# EAGLE design diode_keyboard (EAGLE 7.4.0)
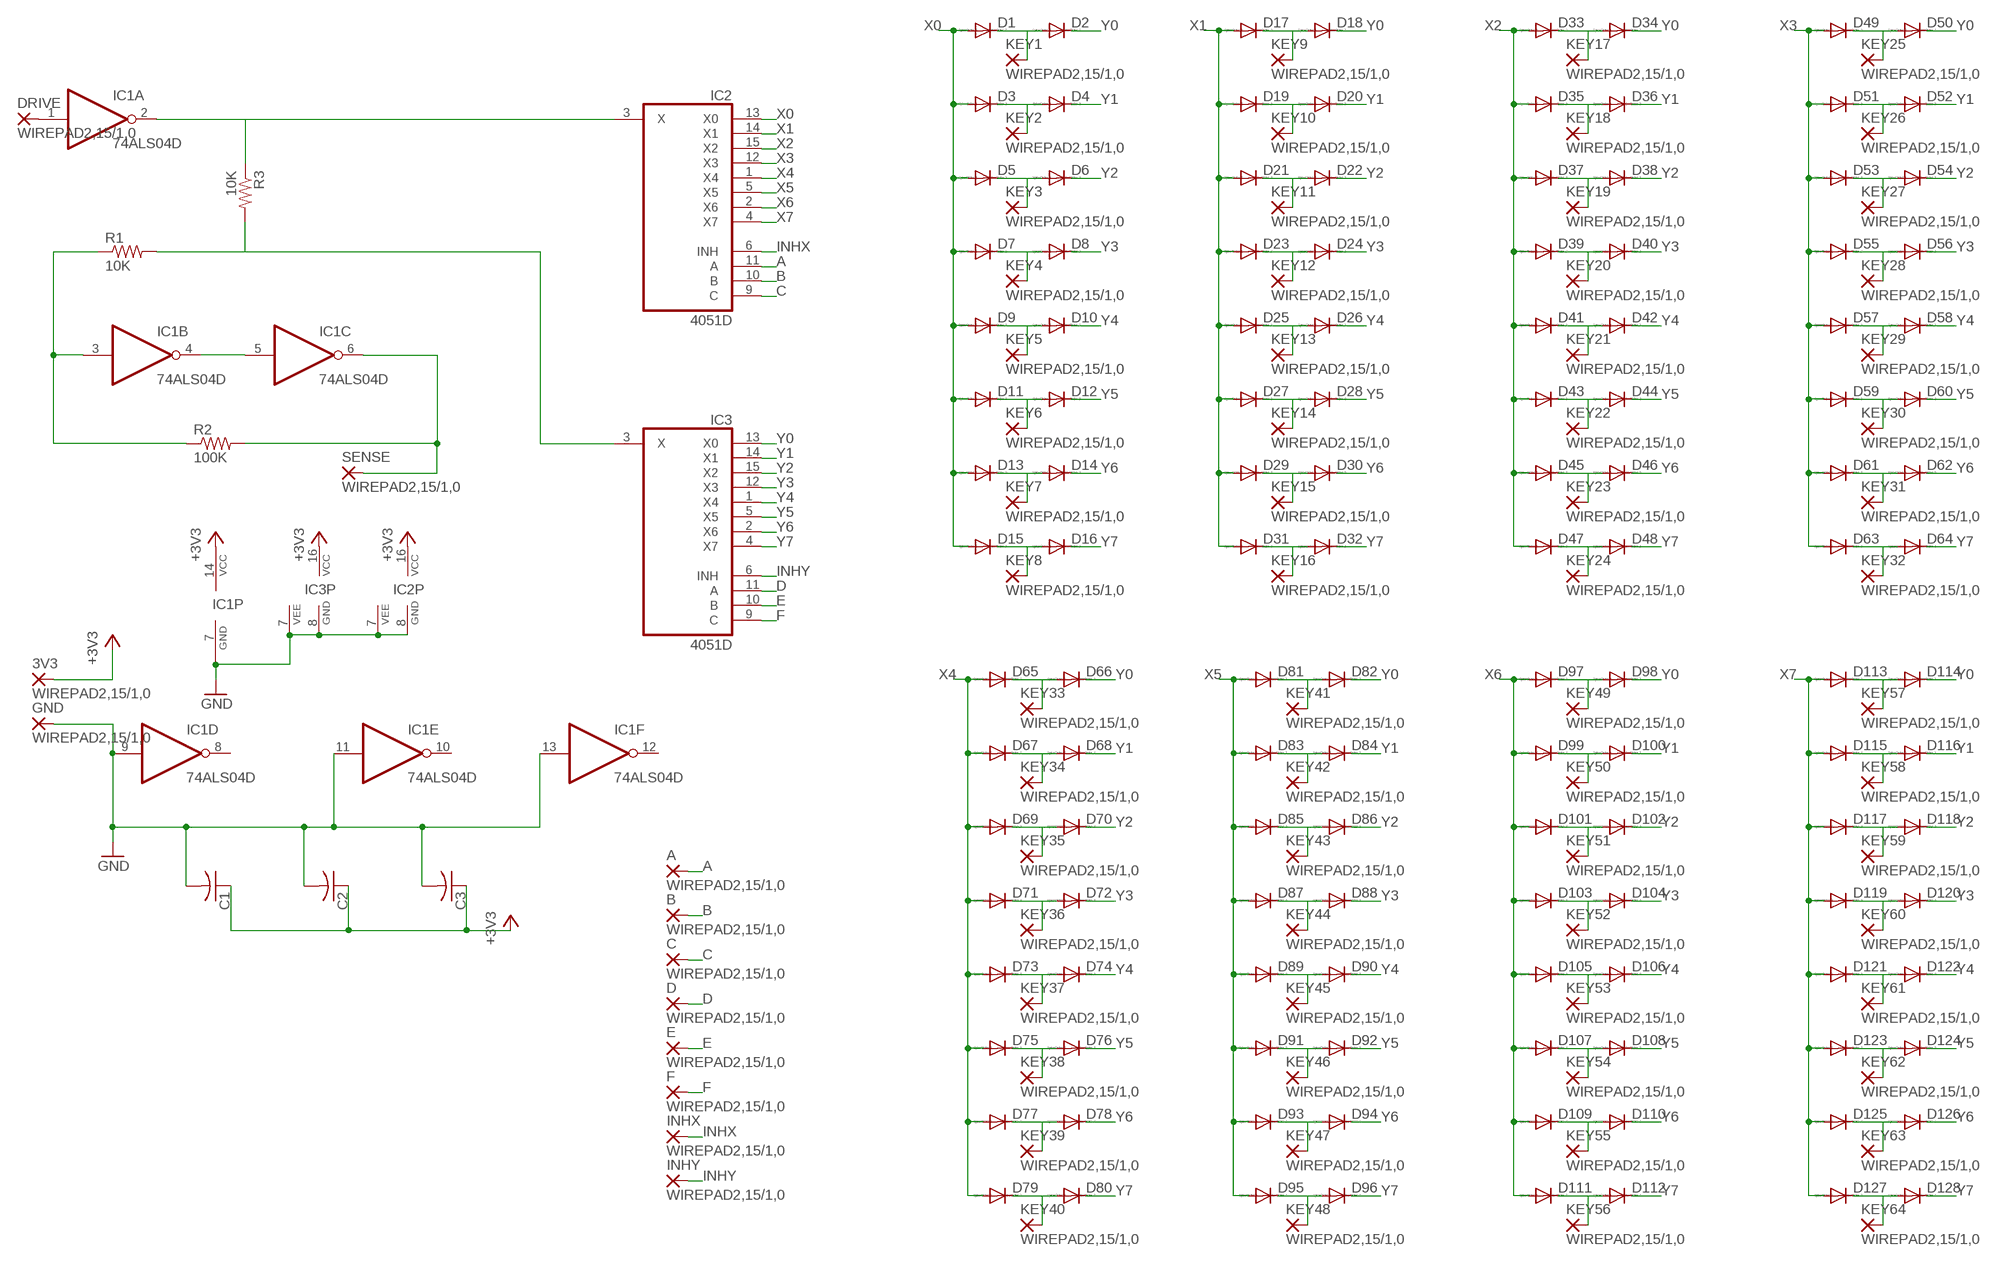
[diagram p0: schematic, sheet 1]

## Parts
3V3  WIREPAD2,15/1,0  [2,15/1,0]
A  WIREPAD2,15/1,0  [2,15/1,0]
B  WIREPAD2,15/1,0  [2,15/1,0]
C  WIREPAD2,15/1,0  [2,15/1,0]
C1  C-US025-024X044  [C025-024X044]
C2  C-US025-024X044  [C025-024X044]
C3  C-US025-024X044  [C025-024X044]
D  WIREPAD2,15/1,0  [2,15/1,0]
D1  DIODE-D-2.5  [D-2.5]
D2  DIODE-D-2.5  [D-2.5]
D3  DIODE-D-2.5  [D-2.5]
D4  DIODE-D-2.5  [D-2.5]
D5  DIODE-D-2.5  [D-2.5]
D6  DIODE-D-2.5  [D-2.5]
D7  DIODE-D-2.5  [D-2.5]
D8  DIODE-D-2.5  [D-2.5]
D9  DIODE-D-2.5  [D-2.5]
D10  DIODE-D-2.5  [D-2.5]
D11  DIODE-D-2.5  [D-2.5]
D12  DIODE-D-2.5  [D-2.5]
D13  DIODE-D-2.5  [D-2.5]
D14  DIODE-D-2.5  [D-2.5]
D15  DIODE-D-2.5  [D-2.5]
D16  DIODE-D-2.5  [D-2.5]
D17  DIODE-D-2.5  [D-2.5]
D18  DIODE-D-2.5  [D-2.5]
D19  DIODE-D-2.5  [D-2.5]
D20  DIODE-D-2.5  [D-2.5]
D21  DIODE-D-2.5  [D-2.5]
D22  DIODE-D-2.5  [D-2.5]
D23  DIODE-D-2.5  [D-2.5]
D24  DIODE-D-2.5  [D-2.5]
D25  DIODE-D-2.5  [D-2.5]
D26  DIODE-D-2.5  [D-2.5]
D27  DIODE-D-2.5  [D-2.5]
D28  DIODE-D-2.5  [D-2.5]
D29  DIODE-D-2.5  [D-2.5]
D30  DIODE-D-2.5  [D-2.5]
D31  DIODE-D-2.5  [D-2.5]
D32  DIODE-D-2.5  [D-2.5]
D33  DIODE-D-2.5  [D-2.5]
D34  DIODE-D-2.5  [D-2.5]
D35  DIODE-D-2.5  [D-2.5]
D36  DIODE-D-2.5  [D-2.5]
D37  DIODE-D-2.5  [D-2.5]
D38  DIODE-D-2.5  [D-2.5]
D39  DIODE-D-2.5  [D-2.5]
D40  DIODE-D-2.5  [D-2.5]
D41  DIODE-D-2.5  [D-2.5]
D42  DIODE-D-2.5  [D-2.5]
D43  DIODE-D-2.5  [D-2.5]
D44  DIODE-D-2.5  [D-2.5]
D45  DIODE-D-2.5  [D-2.5]
D46  DIODE-D-2.5  [D-2.5]
D47  DIODE-D-2.5  [D-2.5]
D48  DIODE-D-2.5  [D-2.5]
D49  DIODE-D-2.5  [D-2.5]
D50  DIODE-D-2.5  [D-2.5]
D51  DIODE-D-2.5  [D-2.5]
D52  DIODE-D-2.5  [D-2.5]
D53  DIODE-D-2.5  [D-2.5]
D54  DIODE-D-2.5  [D-2.5]
D55  DIODE-D-2.5  [D-2.5]
D56  DIODE-D-2.5  [D-2.5]
D57  DIODE-D-2.5  [D-2.5]
D58  DIODE-D-2.5  [D-2.5]
D59  DIODE-D-2.5  [D-2.5]
D60  DIODE-D-2.5  [D-2.5]
D61  DIODE-D-2.5  [D-2.5]
D62  DIODE-D-2.5  [D-2.5]
D63  DIODE-D-2.5  [D-2.5]
D64  DIODE-D-2.5  [D-2.5]
D65  DIODE-D-2.5  [D-2.5]
D66  DIODE-D-2.5  [D-2.5]
D67  DIODE-D-2.5  [D-2.5]
D68  DIODE-D-2.5  [D-2.5]
D69  DIODE-D-2.5  [D-2.5]
D70  DIODE-D-2.5  [D-2.5]
D71  DIODE-D-2.5  [D-2.5]
D72  DIODE-D-2.5  [D-2.5]
D73  DIODE-D-2.5  [D-2.5]
D74  DIODE-D-2.5  [D-2.5]
D75  DIODE-D-2.5  [D-2.5]
D76  DIODE-D-2.5  [D-2.5]
D77  DIODE-D-2.5  [D-2.5]
D78  DIODE-D-2.5  [D-2.5]
D79  DIODE-D-2.5  [D-2.5]
D80  DIODE-D-2.5  [D-2.5]
D81  DIODE-D-2.5  [D-2.5]
D82  DIODE-D-2.5  [D-2.5]
D83  DIODE-D-2.5  [D-2.5]
D84  DIODE-D-2.5  [D-2.5]
D85  DIODE-D-2.5  [D-2.5]
D86  DIODE-D-2.5  [D-2.5]
D87  DIODE-D-2.5  [D-2.5]
D88  DIODE-D-2.5  [D-2.5]
D89  DIODE-D-2.5  [D-2.5]
D90  DIODE-D-2.5  [D-2.5]
D91  DIODE-D-2.5  [D-2.5]
D92  DIODE-D-2.5  [D-2.5]
D93  DIODE-D-2.5  [D-2.5]
D94  DIODE-D-2.5  [D-2.5]
D95  DIODE-D-2.5  [D-2.5]
D96  DIODE-D-2.5  [D-2.5]
D97  DIODE-D-2.5  [D-2.5]
D98  DIODE-D-2.5  [D-2.5]
D99  DIODE-D-2.5  [D-2.5]
D100  DIODE-D-2.5  [D-2.5]
D101  DIODE-D-2.5  [D-2.5]
D102  DIODE-D-2.5  [D-2.5]
D103  DIODE-D-2.5  [D-2.5]
D104  DIODE-D-2.5  [D-2.5]
D105  DIODE-D-2.5  [D-2.5]
D106  DIODE-D-2.5  [D-2.5]
D107  DIODE-D-2.5  [D-2.5]
D108  DIODE-D-2.5  [D-2.5]
D109  DIODE-D-2.5  [D-2.5]
D110  DIODE-D-2.5  [D-2.5]
D111  DIODE-D-2.5  [D-2.5]
D112  DIODE-D-2.5  [D-2.5]
D113  DIODE-D-2.5  [D-2.5]
D114  DIODE-D-2.5  [D-2.5]
D115  DIODE-D-2.5  [D-2.5]
D116  DIODE-D-2.5  [D-2.5]
D117  DIODE-D-2.5  [D-2.5]
D118  DIODE-D-2.5  [D-2.5]
D119  DIODE-D-2.5  [D-2.5]
D120  DIODE-D-2.5  [D-2.5]
D121  DIODE-D-2.5  [D-2.5]
D122  DIODE-D-2.5  [D-2.5]
D123  DIODE-D-2.5  [D-2.5]
D124  DIODE-D-2.5  [D-2.5]
D125  DIODE-D-2.5  [D-2.5]
D126  DIODE-D-2.5  [D-2.5]
D127  DIODE-D-2.5  [D-2.5]
D128  DIODE-D-2.5  [D-2.5]
DRIVE  WIREPAD2,15/1,0  [2,15/1,0]
E  WIREPAD2,15/1,0  [2,15/1,0]
F  WIREPAD2,15/1,0  [2,15/1,0]
GND  WIREPAD2,15/1,0  [2,15/1,0]
IC1  74ALS04D  [SO14]
IC2  4051D  [SO16]
IC3  4051D  [SO16]
INHX  WIREPAD2,15/1,0  [2,15/1,0]
INHY  WIREPAD2,15/1,0  [2,15/1,0]
KEY1  WIREPAD2,15/1,0  [2,15/1,0]
KEY2  WIREPAD2,15/1,0  [2,15/1,0]
KEY3  WIREPAD2,15/1,0  [2,15/1,0]
KEY4  WIREPAD2,15/1,0  [2,15/1,0]
KEY5  WIREPAD2,15/1,0  [2,15/1,0]
KEY6  WIREPAD2,15/1,0  [2,15/1,0]
KEY7  WIREPAD2,15/1,0  [2,15/1,0]
KEY8  WIREPAD2,15/1,0  [2,15/1,0]
KEY9  WIREPAD2,15/1,0  [2,15/1,0]
KEY10  WIREPAD2,15/1,0  [2,15/1,0]
KEY11  WIREPAD2,15/1,0  [2,15/1,0]
KEY12  WIREPAD2,15/1,0  [2,15/1,0]
KEY13  WIREPAD2,15/1,0  [2,15/1,0]
KEY14  WIREPAD2,15/1,0  [2,15/1,0]
KEY15  WIREPAD2,15/1,0  [2,15/1,0]
KEY16  WIREPAD2,15/1,0  [2,15/1,0]
KEY17  WIREPAD2,15/1,0  [2,15/1,0]
KEY18  WIREPAD2,15/1,0  [2,15/1,0]
KEY19  WIREPAD2,15/1,0  [2,15/1,0]
KEY20  WIREPAD2,15/1,0  [2,15/1,0]
KEY21  WIREPAD2,15/1,0  [2,15/1,0]
KEY22  WIREPAD2,15/1,0  [2,15/1,0]
KEY23  WIREPAD2,15/1,0  [2,15/1,0]
KEY24  WIREPAD2,15/1,0  [2,15/1,0]
KEY25  WIREPAD2,15/1,0  [2,15/1,0]
KEY26  WIREPAD2,15/1,0  [2,15/1,0]
KEY27  WIREPAD2,15/1,0  [2,15/1,0]
KEY28  WIREPAD2,15/1,0  [2,15/1,0]
KEY29  WIREPAD2,15/1,0  [2,15/1,0]
KEY30  WIREPAD2,15/1,0  [2,15/1,0]
KEY31  WIREPAD2,15/1,0  [2,15/1,0]
KEY32  WIREPAD2,15/1,0  [2,15/1,0]
KEY33  WIREPAD2,15/1,0  [2,15/1,0]
KEY34  WIREPAD2,15/1,0  [2,15/1,0]
KEY35  WIREPAD2,15/1,0  [2,15/1,0]
KEY36  WIREPAD2,15/1,0  [2,15/1,0]
KEY37  WIREPAD2,15/1,0  [2,15/1,0]
KEY38  WIREPAD2,15/1,0  [2,15/1,0]
KEY39  WIREPAD2,15/1,0  [2,15/1,0]
KEY40  WIREPAD2,15/1,0  [2,15/1,0]
KEY41  WIREPAD2,15/1,0  [2,15/1,0]
KEY42  WIREPAD2,15/1,0  [2,15/1,0]
KEY43  WIREPAD2,15/1,0  [2,15/1,0]
KEY44  WIREPAD2,15/1,0  [2,15/1,0]
KEY45  WIREPAD2,15/1,0  [2,15/1,0]
KEY46  WIREPAD2,15/1,0  [2,15/1,0]
KEY47  WIREPAD2,15/1,0  [2,15/1,0]
KEY48  WIREPAD2,15/1,0  [2,15/1,0]
KEY49  WIREPAD2,15/1,0  [2,15/1,0]
KEY50  WIREPAD2,15/1,0  [2,15/1,0]
KEY51  WIREPAD2,15/1,0  [2,15/1,0]
KEY52  WIREPAD2,15/1,0  [2,15/1,0]
KEY53  WIREPAD2,15/1,0  [2,15/1,0]
KEY54  WIREPAD2,15/1,0  [2,15/1,0]
KEY55  WIREPAD2,15/1,0  [2,15/1,0]
KEY56  WIREPAD2,15/1,0  [2,15/1,0]
KEY57  WIREPAD2,15/1,0  [2,15/1,0]
KEY58  WIREPAD2,15/1,0  [2,15/1,0]
KEY59  WIREPAD2,15/1,0  [2,15/1,0]
KEY60  WIREPAD2,15/1,0  [2,15/1,0]
KEY61  WIREPAD2,15/1,0  [2,15/1,0]
KEY62  WIREPAD2,15/1,0  [2,15/1,0]
KEY63  WIREPAD2,15/1,0  [2,15/1,0]
KEY64  WIREPAD2,15/1,0  [2,15/1,0]
R1  10K  R-US_0207/2V  [0207/2V]
R2  100K  R-US_0207/2V  [0207/2V]
R3  10K  R-US_0207/2V  [0207/2V]
SENSE  WIREPAD2,15/1,0  [2,15/1,0]

## Nets
+3V3: 3V3.1(P) C1.1 C2.1 C3.1 IC1.14(P:VCC) IC2.16(VCC) IC3.16(VCC)
A: A.1(P) IC2.11(A)
B: B.1(P) IC2.10(B)
C: C.1(P) IC2.9(C)
D: D.1(P) IC3.11(A)
E: E.1(P) IC3.10(B)
F: F.1(P) IC3.9(C)
GND: C1.2 C2.2 C3.2 GND.1(P) IC1.7(P:GND) IC1.9(D:I) IC1.11(E:I) IC1.13(F:I) IC2.7(VEE) IC2.8(GND) IC3.7(VEE) IC3.8(GND)
INHX: IC2.6(INH) INHX.1(P)
INHY: IC3.6(INH) INHY.1(P)
N$1: IC1.4(B:O) IC1.5(C:I)
N$2: IC1.3(B:I) R1.1 R2.1
N$3: IC3.3(X) R1.2 R3.2
N$4: IC1.2(A:O) IC2.3(X) R3.1
N$5: IC1.6(C:O) R2.2 SENSE.1(P)
N$6: D17.C D18.A KEY9.1(P)
N$7: DRIVE.1(P) IC1.1(A:I)
N$8: D1.C D2.A KEY1.1(P)
N$9: D19.C D20.A KEY10.1(P)
N$10: D3.C D4.A KEY2.1(P)
N$13: D5.C D6.A KEY3.1(P)
N$14: D21.C D22.A KEY11.1(P)
N$15: D23.C D24.A KEY12.1(P)
N$16: D7.C D8.A KEY4.1(P)
N$17: D25.C D26.A KEY13.1(P)
N$18: D27.C D28.A KEY14.1(P)
N$19: D9.C D10.A KEY5.1(P)
N$20: D29.C D30.A KEY15.1(P)
N$21: D31.C D32.A KEY16.1(P)
N$22: D11.C D12.A KEY6.1(P)
N$23: D33.C D34.A KEY17.1(P)
N$24: D35.C D36.A KEY18.1(P)
N$25: D13.C D14.A KEY7.1(P)
N$27: D37.C D38.A KEY19.1(P)
N$28: D15.C D16.A KEY8.1(P)
N$29: D39.C D40.A KEY20.1(P)
N$30: D41.C D42.A KEY21.1(P)
N$31: D43.C D44.A KEY22.1(P)
N$32: D45.C D46.A KEY23.1(P)
N$33: D47.C D48.A KEY24.1(P)
N$34: D49.C D50.A KEY25.1(P)
N$35: D51.C D52.A KEY26.1(P)
N$37: D53.C D54.A KEY27.1(P)
N$38: D55.C D56.A KEY28.1(P)
N$39: D57.C D58.A KEY29.1(P)
N$40: D59.C D60.A KEY30.1(P)
N$41: D61.C D62.A KEY31.1(P)
N$42: D63.C D64.A KEY32.1(P)
N$43: D65.C D66.A KEY33.1(P)
N$44: D67.C D68.A KEY34.1(P)
N$46: D69.C D70.A KEY35.1(P)
N$47: D71.C D72.A KEY36.1(P)
N$48: D73.C D74.A KEY37.1(P)
N$49: D75.C D76.A KEY38.1(P)
N$50: D77.C D78.A KEY39.1(P)
N$51: D79.C D80.A KEY40.1(P)
N$52: D81.C D82.A KEY41.1(P)
N$53: D83.C D84.A KEY42.1(P)
N$55: D85.C D86.A KEY43.1(P)
N$56: D87.C D88.A KEY44.1(P)
N$57: D89.C D90.A KEY45.1(P)
N$58: D91.C D92.A KEY46.1(P)
N$59: D93.C D94.A KEY47.1(P)
N$60: D95.C D96.A KEY48.1(P)
N$61: D97.C D98.A KEY49.1(P)
N$62: D99.C D100.A KEY50.1(P)
N$64: D101.C D102.A KEY51.1(P)
N$65: D103.C D104.A KEY52.1(P)
N$66: D105.C D106.A KEY53.1(P)
N$67: D107.C D108.A KEY54.1(P)
N$68: D109.C D110.A KEY55.1(P)
N$69: D111.C D112.A KEY56.1(P)
N$70: D113.C D114.A KEY57.1(P)
N$71: D115.C D116.A KEY58.1(P)
N$73: D117.C D118.A KEY59.1(P)
N$74: D119.C D120.A KEY60.1(P)
N$75: D121.C D122.A KEY61.1(P)
N$76: D123.C D124.A KEY62.1(P)
N$77: D125.C D126.A KEY63.1(P)
N$78: D127.C D128.A KEY64.1(P)
X0: D1.A D3.A D5.A D7.A D9.A D11.A D13.A D15.A IC2.13(X0)
X1: D17.A D19.A D21.A D23.A D25.A D27.A D29.A D31.A IC2.14(X1)
X2: D33.A D35.A D37.A D39.A D41.A D43.A D45.A D47.A IC2.15(X2)
X3: D49.A D51.A D53.A D55.A D57.A D59.A D61.A D63.A IC2.12(X3)
X4: D65.A D67.A D69.A D71.A D73.A D75.A D77.A D79.A IC2.1(X4)
X5: D81.A D83.A D85.A D87.A D89.A D91.A D93.A D95.A IC2.5(X5)
X6: D97.A D99.A D101.A D103.A D105.A D107.A D109.A D111.A IC2.2(X6)
X7: D113.A D115.A D117.A D119.A D121.A D123.A D125.A D127.A IC2.4(X7)
Y0: D2.C D18.C D34.C D50.C D66.C D82.C D98.C D114.C IC3.13(X0)
Y1: D4.C D20.C D36.C D52.C D68.C D84.C D100.C D116.C IC3.14(X1)
Y2: D6.C D22.C D38.C D54.C D70.C D86.C D102.C D118.C IC3.15(X2)
Y3: D8.C D24.C D40.C D56.C D72.C D88.C D104.C D120.C IC3.12(X3)
Y4: D10.C D26.C D42.C D58.C D74.C D90.C D106.C D122.C IC3.1(X4)
Y5: D12.C D28.C D44.C D60.C D76.C D92.C D108.C D124.C IC3.5(X5)
Y6: D14.C D30.C D46.C D62.C D78.C D94.C D110.C D126.C IC3.2(X6)
Y7: D16.C D32.C D48.C D64.C D80.C D96.C D112.C D128.C IC3.4(X7)
Unconnected: IC1.8(D:O) IC1.10(E:O) IC1.12(F:O)

## Library data of the parts
3V3 A B C D DRIVE E F GND INHX INHY KEY1-KEY64 SENSE = wirepad:WIREPAD: Wire PAD connect wire on PCB
C1-C3 = rcl:C-US: CAPACITOR, American symbol
D1-D128 = diode:DIODE-: DIODE
IC1 = 74xx-us:74*04: Hex INVERTER
IC2 IC3 = 40xx:4051: 8-channel ANALOG MULTIPLEXER
R1-R3 = rcl:R-US_: RESISTOR, American symbol

## Board
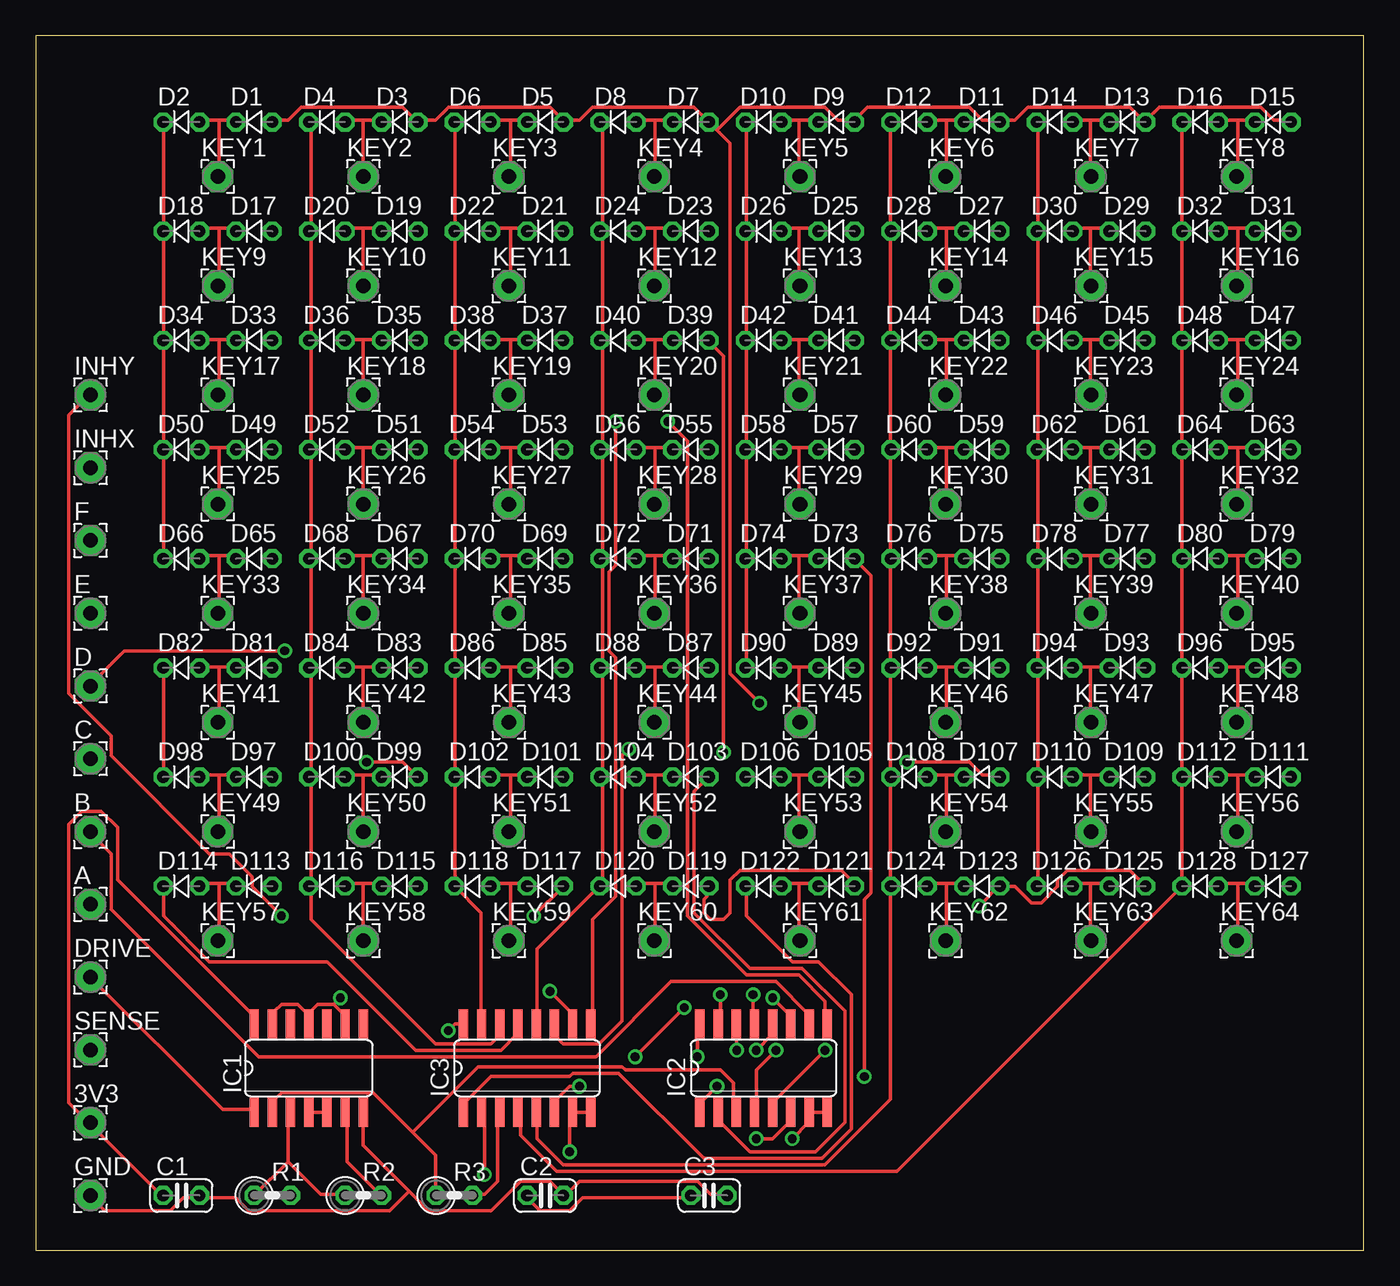
[diagram p1: board, top side]
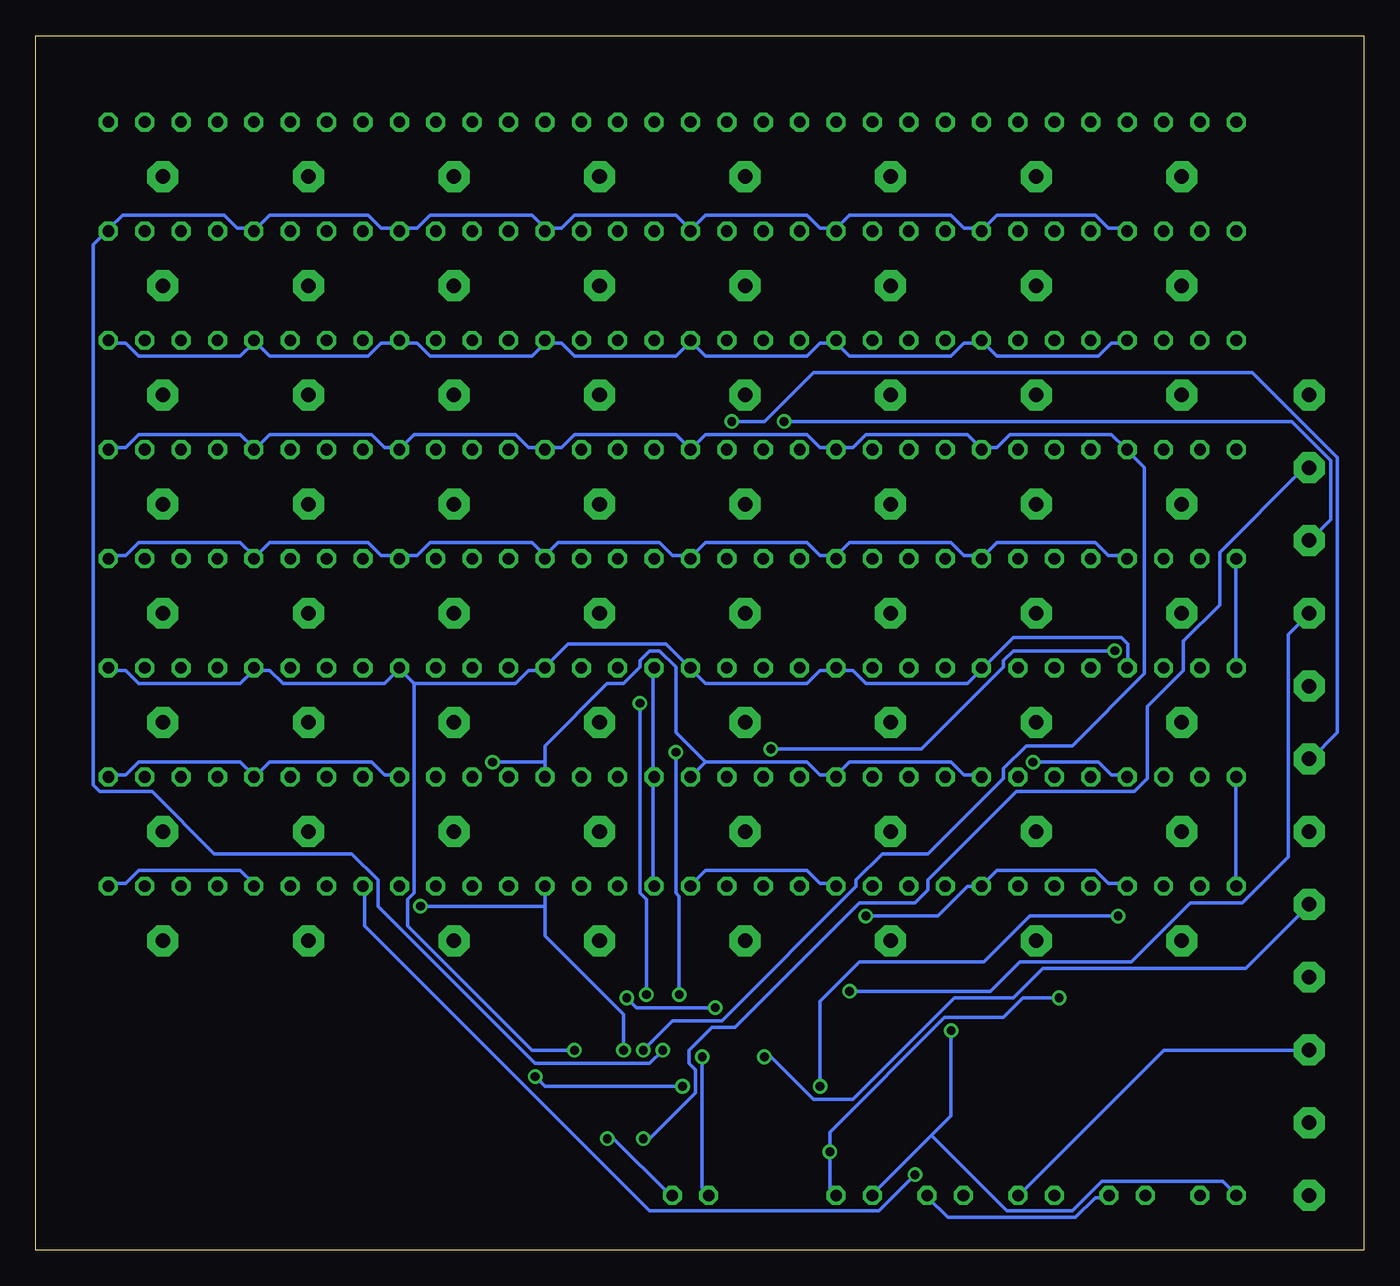
[diagram p2: board, bottom side, seen from below]

Size 92.69 x 84.76 mm. Coordinates in mm from the lower left corner, seen from the top.
Outline: 0,0 92.69,0 92.69,84.76 0,84.76 0,0
Copper layers (1*16): Top 0.035mm / dielectric 1.5mm / Bottom 0.035mm
Design rules "default": minimum track width 10mil, minimum drill 24mil, track to track 8mil, track to pad 8mil, pad to pad 8mil, via to via 8mil, smd to smd 8mil, copper to edge 40mil, drill to drill 8mil, minimum pad ring 10mil, minimum via ring 8mil, stop-mask expansion 4mil, vias tented up to drill 0mil, thermal gap 10mil

### Footprints (pad centres in the part's own frame; a part is rotated, then mirrored left to right if it is on the bottom)
2,15/1,0 = drill 1.016 pad 2.159 octagon: 1 0,0
C025-024X044 = drill 0.813 octagon: 1 -1.27,0; 2 1.27,0
D-2.5 = drill 0.813 octagon: A 1.27,0; C -1.27,0
SO14 = smd 0.66 x 2.032: 1 -3.81,-3.073; 2 -2.54,-3.073; 3 -1.27,-3.073; 4 0,-3.073; 5 1.27,-3.073; 6 2.54,-3.073; 7 3.81,-3.073; 8 3.81,3.073; 9 2.54,3.073; 10 1.27,3.073; 11 0,3.073; 12 -1.27,3.073; 13 -2.54,3.073; 14 -3.81,3.073
SO16 = smd 0.66 x 2.032: 1 -4.445,-3.073; 2 -3.175,-3.073; 3 -1.905,-3.073; 4 -0.635,-3.073; 5 0.635,-3.073; 6 1.905,-3.073; 7 3.175,-3.073; 8 4.445,-3.073; 9 4.445,3.073; 10 3.175,3.073; 11 1.905,3.073; 12 0.635,3.073; 13 -0.635,3.073; 14 -1.905,3.073; 15 -3.175,3.073; 16 -4.445,3.073
0207/2V = drill 0.813 octagon: 1 -1.27,0; 2 1.27,0

### Placement (x,y rotation side)
3V3  3.81,8.89 0 top
A  3.81,24.13 0 top
B  3.81,29.21 0 top
C  3.81,34.29 0 top
C1  10.16,3.81 0 top
C2  35.56,3.81 0 top
C3  46.99,3.81 0 top
D  3.81,39.37 0 top
D1  15.24,78.74 0 top
D2  10.16,78.74 0 top
D3  25.4,78.74 0 top
D4  20.32,78.74 0 top
D5  35.56,78.74 0 top
D6  30.48,78.74 0 top
D7  45.72,78.74 0 top
D8  40.64,78.74 0 top
D9  55.88,78.74 0 top
D10  50.8,78.74 0 top
D11  66.04,78.74 0 top
D12  60.96,78.74 0 top
D13  76.2,78.74 0 top
D14  71.12,78.74 0 top
D15  86.36,78.74 0 top
D16  81.28,78.74 0 top
D17  15.24,71.12 0 top
D18  10.16,71.12 0 top
D19  25.4,71.12 0 top
D20  20.32,71.12 0 top
D21  35.56,71.12 0 top
D22  30.48,71.12 0 top
D23  45.72,71.12 0 top
D24  40.64,71.12 0 top
D25  55.88,71.12 0 top
D26  50.8,71.12 0 top
D27  66.04,71.12 0 top
D28  60.96,71.12 0 top
D29  76.2,71.12 0 top
D30  71.12,71.12 0 top
D31  86.36,71.12 0 top
D32  81.28,71.12 0 top
D33  15.24,63.5 0 top
D34  10.16,63.5 0 top
D35  25.4,63.5 0 top
D36  20.32,63.5 0 top
D37  35.56,63.5 0 top
D38  30.48,63.5 0 top
D39  45.72,63.5 0 top
D40  40.64,63.5 0 top
D41  55.88,63.5 0 top
D42  50.8,63.5 0 top
D43  66.04,63.5 0 top
D44  60.96,63.5 0 top
D45  76.2,63.5 0 top
D46  71.12,63.5 0 top
D47  86.36,63.5 0 top
D48  81.28,63.5 0 top
D49  15.24,55.88 0 top
D50  10.16,55.88 0 top
D51  25.4,55.88 0 top
D52  20.32,55.88 0 top
D53  35.56,55.88 0 top
D54  30.48,55.88 0 top
D55  45.72,55.88 0 top
D56  40.64,55.88 0 top
D57  55.88,55.88 0 top
D58  50.8,55.88 0 top
D59  66.04,55.88 0 top
D60  60.96,55.88 0 top
D61  76.2,55.88 0 top
D62  71.12,55.88 0 top
D63  86.36,55.88 0 top
D64  81.28,55.88 0 top
D65  15.24,48.26 0 top
D66  10.16,48.26 0 top
D67  25.4,48.26 0 top
D68  20.32,48.26 0 top
D69  35.56,48.26 0 top
D70  30.48,48.26 0 top
D71  45.72,48.26 0 top
D72  40.64,48.26 0 top
D73  55.88,48.26 0 top
D74  50.8,48.26 0 top
D75  66.04,48.26 0 top
D76  60.96,48.26 0 top
D77  76.2,48.26 0 top
D78  71.12,48.26 0 top
D79  86.36,48.26 0 top
D80  81.28,48.26 0 top
D81  15.24,40.64 0 top
D82  10.16,40.64 0 top
D83  25.4,40.64 0 top
D84  20.32,40.64 0 top
D85  35.56,40.64 0 top
D86  30.48,40.64 0 top
D87  45.72,40.64 0 top
D88  40.64,40.64 0 top
D89  55.88,40.64 0 top
D90  50.8,40.64 0 top
D91  66.04,40.64 0 top
D92  60.96,40.64 0 top
D93  76.2,40.64 0 top
D94  71.12,40.64 0 top
D95  86.36,40.64 0 top
D96  81.28,40.64 0 top
D97  15.24,33.02 0 top
D98  10.16,33.02 0 top
D99  25.4,33.02 0 top
D100  20.32,33.02 0 top
D101  35.56,33.02 0 top
D102  30.48,33.02 0 top
D103  45.72,33.02 0 top
D104  40.64,33.02 0 top
D105  55.88,33.02 0 top
D106  50.8,33.02 0 top
D107  66.04,33.02 0 top
D108  60.96,33.02 0 top
D109  76.2,33.02 0 top
D110  71.12,33.02 0 top
D111  86.36,33.02 0 top
D112  81.28,33.02 0 top
D113  15.24,25.4 0 top
D114  10.16,25.4 0 top
D115  25.4,25.4 0 top
D116  20.32,25.4 0 top
D117  35.56,25.4 0 top
D118  30.48,25.4 0 top
D119  45.72,25.4 0 top
D120  40.64,25.4 0 top
D121  55.88,25.4 0 top
D122  50.8,25.4 0 top
D123  66.04,25.4 0 top
D124  60.96,25.4 0 top
D125  76.2,25.4 0 top
D126  71.12,25.4 0 top
D127  86.36,25.4 0 top
D128  81.28,25.4 0 top
DRIVE  3.81,19.05 0 top
E  3.81,44.45 0 top
F  3.81,49.53 0 top
GND  3.81,3.81 0 top
IC1  19.05,12.7 0 top
IC2  50.8,12.7 0 top
IC3  34.29,12.7 0 top
INHX  3.81,54.61 0 top
INHY  3.81,59.69 0 top
KEY1  12.7,74.93 0 top
KEY2  22.86,74.93 0 top
KEY3  33.02,74.93 0 top
KEY4  43.18,74.93 0 top
KEY5  53.34,74.93 0 top
KEY6  63.5,74.93 0 top
KEY7  73.66,74.93 0 top
KEY8  83.82,74.93 0 top
KEY9  12.7,67.31 0 top
KEY10  22.86,67.31 0 top
KEY11  33.02,67.31 0 top
KEY12  43.18,67.31 0 top
KEY13  53.34,67.31 0 top
KEY14  63.5,67.31 0 top
KEY15  73.66,67.31 0 top
KEY16  83.82,67.31 0 top
KEY17  12.7,59.69 0 top
KEY18  22.86,59.69 0 top
KEY19  33.02,59.69 0 top
KEY20  43.18,59.69 0 top
KEY21  53.34,59.69 0 top
KEY22  63.5,59.69 0 top
KEY23  73.66,59.69 0 top
KEY24  83.82,59.69 0 top
KEY25  12.7,52.07 0 top
KEY26  22.86,52.07 0 top
KEY27  33.02,52.07 0 top
KEY28  43.18,52.07 0 top
KEY29  53.34,52.07 0 top
KEY30  63.5,52.07 0 top
KEY31  73.66,52.07 0 top
KEY32  83.82,52.07 0 top
KEY33  12.7,44.45 0 top
KEY34  22.86,44.45 0 top
KEY35  33.02,44.45 0 top
KEY36  43.18,44.45 0 top
KEY37  53.34,44.45 0 top
KEY38  63.5,44.45 0 top
KEY39  73.66,44.45 0 top
KEY40  83.82,44.45 0 top
KEY41  12.7,36.83 0 top
KEY42  22.86,36.83 0 top
KEY43  33.02,36.83 0 top
KEY44  43.18,36.83 0 top
KEY45  53.34,36.83 0 top
KEY46  63.5,36.83 0 top
KEY47  73.66,36.83 0 top
KEY48  83.82,36.83 0 top
KEY49  12.7,29.21 0 top
KEY50  22.86,29.21 0 top
KEY51  33.02,29.21 0 top
KEY52  43.18,29.21 0 top
KEY53  53.34,29.21 0 top
KEY54  63.5,29.21 0 top
KEY55  73.66,29.21 0 top
KEY56  83.82,29.21 0 top
KEY57  12.7,21.59 0 top
KEY58  22.86,21.59 0 top
KEY59  33.02,21.59 0 top
KEY60  43.18,21.59 0 top
KEY61  53.34,21.59 0 top
KEY62  63.5,21.59 0 top
KEY63  73.66,21.59 0 top
KEY64  83.82,21.59 0 top
R1  16.51,3.81 0 top
R2  22.86,3.81 0 top
R3  29.21,3.81 0 top
SENSE  3.81,13.97 0 top

### Tracks (layer width: path | path; a pad name or v marks a point on that pad's centre or on a via)
+3V3  (via drill 0.61)
  Top 0.254: v46.18,13.49 46.18,15.77 IC2.16 | IC3.16 29.26,15.77 v28.8,15.32 | C3.1 45.72,3.66 38.18,3.66 37.26,2.74 35.2,2.74 34.29,3.66 C2.1 | IC1.14 15.09,15.77 15.09,16.46 5.71,25.83 5.71,29.49 4.57,30.63 3.2,30.63 2.29,29.72 2.29,10.29 3.66,8.91 3V3.1 3.89,8.69 8.69,3.89 C1.1
  Bottom 0.254: v46.18,13.49 46.18,4.34 45.72,3.89 C3.1 | v28.8,15.32 28.8,9.37 30.18,8 | 30.18,8 34.29,3.89 C2.1 | 30.18,8 24.92,2.74 20.34,2.74 18.29,4.8 9.83,4.8 8.91,3.89 C1.1
A  (via drill 0.61)
  Top 0.254: v51.44,17.6 52.58,16.46 52.58,15.77 IC2.11 | v41.83,13.49 v45.26,16.92
  Bottom 0.254: v51.44,17.6 50.75,16.92 v45.26,16.92 | v41.83,13.49 41.38,13.49 38.41,10.52 35.66,10.52 28.57,17.6 24.46,17.6 22.4,19.66 8.23,19.66 3.89,24 A.1
B
  Top 0.254: IC2.10 53.95,15.77 53.95,16.46 51.66,18.75 44.35,18.75 39.09,13.49 15.54,13.49 5.26,23.77 5.26,27.66 3.89,29.03 B.1
C  (via drill 0.61)
  Top 0.254: v44.12,57.84 45.49,56.46 45.49,23.32 49.61,19.2 53.26,19.2 55.09,17.37 55.09,15.77 IC2.9
  Bottom 0.254: v44.12,57.84 41.83,57.84 38.41,61.27 7.77,61.27 1.83,55.32 1.83,36.12 3.66,34.29 C.1
D  (via drill 0.61)
  Top 0.254: v41.38,34.98 40.92,34.52 40.92,16 39.32,14.4 36.8,14.4 36.35,14.86 36.35,15.77 IC3.11 | v17.37,41.83 6.17,41.83 3.89,39.55 D.1
  Bottom 0.254: v41.38,34.98 30.86,34.98 25.15,40.69 25.15,41.15 24.46,41.83 v17.37,41.83
E  (via drill 0.61)
  Top 0.254: v35.89,18.06 37.26,16.69 37.26,15.77 IC3.10
  Bottom 0.254: v35.89,18.06 26.06,18.06 24,20.12 16.23,20.12 12.12,24.23 8.46,24.23 5.26,27.43 5.26,42.98 3.89,44.35 E.1
F  (via drill 0.61)
  Top 0.254: v40.46,57.84 40.46,47.78 40.01,47.32 40.01,41.83 40.46,41.38 40.46,24.69 38.86,23.09 38.86,15.77 IC3.9
  Bottom 0.254: v40.46,57.84 5.03,57.84 2.29,55.09 2.29,50.98 3.66,49.61 F.1
GND  (via drill 0.61)
  Top 0.254: IC2.8 55.09,9.6 54.18,9.6 IC2.7 53.95,9.6 53.95,8.91 v52.81,7.77 | 11.43,3.66 10.29,3.66 9.37,2.74 4.8,2.74 3.89,3.66 GND.1 | 18.97,16.46 18.29,17.14 17.14,17.14 16.69,16.69 16.69,15.77 IC1.13 | 18.97,16.46 18.97,15.77 IC1.11 18.97,16.46 | 20.8,17.14 21.49,16.46 21.49,15.77 IC1.9 | 20.8,17.14 19.66,17.14 18.97,16.46 | IC3.8 38.63,9.6 37.49,9.6 IC3.7 37.26,9.6 v37.26,6.86 | IC1.7 22.86,7.32 26.06,4.12 | 26.06,4.12 27.43,2.74 31.77,2.74 33.83,4.8 35.89,4.8 36.8,3.89 C2.2 37.03,3.89 37.95,4.8 46.18,4.8 47.09,3.89 48.23,3.89 C3.2 | v21.26,17.6 20.8,17.14 | 11.43,3.66 13.95,3.66 14.86,2.74 24.69,2.74 26.06,4.12 | 11.43,3.66 C1.2
  Bottom 0.254: v52.81,7.77 52.35,7.77 48.46,3.89 C3.2 | C2.2 37.03,3.89 37.26,4.12 v37.26,6.86 37.26,8.23 29.26,16.23 25.15,16.23 23.77,17.6 v21.26,17.6
INHX  (via drill 0.61)
  Top 0.254: v50.29,7.77 51.44,7.77 52.58,8.91 52.58,9.6 IC2.6
  Bottom 0.254: v50.29,7.77 49.84,7.77 46.63,10.97 46.63,12.57 47.09,13.03 47.09,13.95 45.49,15.54 43.89,15.54 35.2,24.23 31.32,24.23 30.4,25.15 30.4,25.83 24.23,32 16,32 15.09,32.92 15.09,37.95 12.57,40.46 12.57,42.52 10.06,45.03 10.06,48.69 4.34,54.41 3.89,54.41 INHX.1
INHY  (via drill 0.61)
  Top 0.254: v37.95,11.43 37.26,11.43 36.35,10.52 36.35,9.83 IC3.6 | v17.14,23.32 15.09,25.38 15.09,26.06 13.49,27.66 12.12,27.66 5.26,34.52 5.26,35.89 2.29,38.86 2.29,58.29 3.66,59.66 INHY.1
  Bottom 0.254: v37.95,11.43 37.95,17.37 35.2,20.12 26.52,20.12 23.32,23.32 v17.14,23.32
N$1
  Top 0.254: IC1.4 19.2,9.6 20.12,9.6 IC1.5
N$2
  Top 0.254: 17.6,6.17 17.6,9.6 IC1.3 | R1.1 17.6,6.17 | 17.6,6.17 19.89,3.89 21.49,3.89 R2.1
N$3
  Top 0.254: IC3.3 32.23,9.6 32.23,4.8 31.32,3.89 30.63,3.89 R3.2
  Bottom 0.254: R1.2 17.83,3.66 18.75,3.66 20.12,2.29 29.03,2.29 30.4,3.66 R3.2
N$4
  Top 0.254: 26.29,8.23 27.89,6.63 27.89,3.89 R3.1 | 26.29,8.23 23.55,10.97 17.14,10.97 16.69,10.52 16.69,9.83 IC1.2 | 26.29,8.23 30.86,12.8 40.92,12.8 41.15,12.57 47.78,12.57 48.69,11.66 48.69,9.83 IC2.3
N$5
  Top 0.254: IC1.6 21.72,9.6 21.72,6.17 24,3.89 R2.2
  Bottom 0.254: SENSE.1 3.89,13.95 13.95,13.95 24,3.89 R2.2
N$6
  Top 0.254: 12.8,71.32 13.95,71.32 D17.C | 12.8,71.32 11.43,71.32 D18.A | 12.8,71.32 12.8,67.44 KEY9.1
N$7
  Top 0.254: DRIVE.1 13.03,9.83 15.09,9.83 IC1.1
N$8
  Top 0.254: 12.8,78.87 13.95,78.87 D1.C | 12.8,78.87 11.43,78.87 D2.A | 12.8,78.87 12.8,74.98 KEY1.1
N$9
  Top 0.254: 22.86,71.32 24,71.32 D19.C | 22.86,71.32 21.72,71.32 D20.A | KEY10.1 22.86,71.32
N$10
  Top 0.254: 22.86,78.87 24,78.87 D3.C | 22.86,78.87 21.72,78.87 D4.A | KEY2.1 22.86,78.87
N$13
  Top 0.254: 33.15,78.87 34.29,78.87 D5.C | 33.15,78.87 31.77,78.87 D6.A | 33.15,78.87 33.15,74.98 KEY3.1
N$14
  Top 0.254: 33.15,71.32 34.29,71.32 D21.C | 33.15,71.32 31.77,71.32 D22.A | 33.15,71.32 33.15,67.44 KEY11.1
N$15
  Top 0.254: 43.2,71.32 44.35,71.32 D23.C | 43.2,71.32 42.06,71.32 D24.A | 43.2,71.32 43.2,67.44 KEY12.1
N$16
  Top 0.254: 43.2,78.87 44.35,78.87 D7.C | 43.2,78.87 42.06,78.87 D8.A | 43.2,78.87 43.2,74.98 KEY4.1
N$17
  Top 0.254: 53.26,71.32 54.41,71.32 D25.C | 53.26,71.32 52.12,71.32 D26.A | 53.26,71.32 53.26,67.44 KEY13.1
N$18
  Top 0.254: 63.55,71.32 64.69,71.32 D27.C | 63.55,71.32 62.41,71.32 D28.A | 63.55,71.32 63.55,67.44 KEY14.1
N$19
  Top 0.254: 53.26,78.87 54.41,78.87 D9.C | 53.26,78.87 52.12,78.87 D10.A | 53.26,78.87 53.26,74.98 KEY5.1
N$20
  Top 0.254: 73.61,71.32 74.75,71.32 D29.C | 73.61,71.32 72.47,71.32 D30.A | 73.61,71.32 73.61,67.44 KEY15.1
N$21
  Top 0.254: 83.9,71.32 85.04,71.32 D31.C | 83.9,71.32 82.75,71.32 D32.A | 83.9,71.32 83.9,67.44 KEY16.1
N$22
  Top 0.254: 63.55,78.87 64.69,78.87 D11.C | 63.55,78.87 62.41,78.87 D12.A | 63.55,78.87 63.55,74.98 KEY6.1
N$23
  Top 0.254: 12.8,63.55 13.95,63.55 D33.C | 12.8,63.55 11.43,63.55 D34.A | 12.8,63.55 12.8,59.89 KEY17.1
N$24
  Top 0.254: 22.86,63.55 24,63.55 D35.C | 22.86,63.55 21.72,63.55 D36.A | KEY18.1 22.86,63.55
N$25
  Top 0.254: 73.61,78.87 74.75,78.87 D13.C | 73.61,78.87 72.47,78.87 D14.A | 73.61,78.87 73.61,74.98 KEY7.1
N$27
  Top 0.254: 33.15,63.55 34.29,63.55 D37.C | 33.15,63.55 31.77,63.55 D38.A | 33.15,63.55 33.15,59.89 KEY19.1
N$28
  Top 0.254: 83.9,78.87 85.04,78.87 D15.C | 83.9,78.87 82.75,78.87 D16.A | 83.9,78.87 83.9,74.98 KEY8.1
N$29
  Top 0.254: 43.2,63.55 44.35,63.55 D39.C | 43.2,63.55 42.06,63.55 D40.A | 43.2,63.55 43.2,59.89 KEY20.1
N$30
  Top 0.254: 53.26,63.55 54.41,63.55 D41.C | 53.26,63.55 52.12,63.55 D42.A | 53.26,63.55 53.26,59.89 KEY21.1
N$31
  Top 0.254: 63.55,63.55 64.69,63.55 D43.C | 63.55,63.55 62.41,63.55 D44.A | 63.55,63.55 63.55,59.89 KEY22.1
N$32
  Top 0.254: 73.61,63.55 74.75,63.55 D45.C | 73.61,63.55 72.47,63.55 D46.A | 73.61,63.55 73.61,59.89 KEY23.1
N$33
  Top 0.254: 83.9,63.55 85.04,63.55 D47.C | 83.9,63.55 82.75,63.55 D48.A | 83.9,63.55 83.9,59.89 KEY24.1
N$34
  Top 0.254: 12.8,56.01 13.95,56.01 D49.C | 12.8,56.01 11.43,56.01 D50.A | 12.8,56.01 12.8,52.12 KEY25.1
N$35
  Top 0.254: 22.86,56.01 24,56.01 D51.C | 22.86,56.01 21.72,56.01 D52.A | KEY26.1 22.86,56.01
N$37
  Top 0.254: 33.15,56.01 34.29,56.01 D53.C | 33.15,56.01 31.77,56.01 D54.A | 33.15,56.01 33.15,52.12 KEY27.1
N$38
  Top 0.254: 43.2,56.01 44.35,56.01 D55.C | 43.2,56.01 42.06,56.01 D56.A | 43.2,56.01 43.2,52.12 KEY28.1
N$39
  Top 0.254: 53.26,56.01 54.41,56.01 D57.C | 53.26,56.01 52.12,56.01 D58.A | 53.26,56.01 53.26,52.12 KEY29.1
N$40
  Top 0.254: 63.55,56.01 64.69,56.01 D59.C | 63.55,56.01 62.41,56.01 D60.A | 63.55,56.01 63.55,52.12 KEY30.1
N$41
  Top 0.254: 73.61,56.01 74.75,56.01 D61.C | 73.61,56.01 72.47,56.01 D62.A | 73.61,56.01 73.61,52.12 KEY31.1
N$42
  Top 0.254: 83.9,56.01 85.04,56.01 D63.C | 83.9,56.01 82.75,56.01 D64.A | 83.9,56.01 83.9,52.12 KEY32.1
N$43
  Top 0.254: 12.8,48.46 13.95,48.46 D65.C | 12.8,48.46 11.43,48.46 D66.A | 12.8,48.46 12.8,44.58 KEY33.1
N$44
  Top 0.254: 22.86,48.46 24,48.46 D67.C | 22.86,48.46 21.72,48.46 D68.A | KEY34.1 22.86,48.46
N$46
  Top 0.254: 33.15,48.46 34.29,48.46 D69.C | 33.15,48.46 31.77,48.46 D70.A | 33.15,48.46 33.15,44.58 KEY35.1
N$47
  Top 0.254: 43.2,48.46 44.35,48.46 D71.C | 43.2,48.46 42.06,48.46 D72.A | 43.2,48.46 43.2,44.58 KEY36.1
N$48
  Top 0.254: 53.26,48.46 54.41,48.46 D73.C | 53.26,48.46 52.12,48.46 D74.A | 53.26,48.46 53.26,44.58 KEY37.1
N$49
  Top 0.254: 63.55,48.46 64.69,48.46 D75.C | 63.55,48.46 62.41,48.46 D76.A | 63.55,48.46 63.55,44.58 KEY38.1
N$50
  Top 0.254: 73.61,48.46 74.75,48.46 D77.C | 73.61,48.46 72.47,48.46 D78.A | 73.61,48.46 73.61,44.58 KEY39.1
N$51
  Top 0.254: 83.9,48.46 85.04,48.46 D79.C | 83.9,48.46 82.75,48.46 D80.A | 83.9,48.46 83.9,44.58 KEY40.1
N$52
  Top 0.254: 12.8,40.69 13.95,40.69 D81.C | 12.8,40.69 11.43,40.69 D82.A | 12.8,40.69 12.8,37.03 KEY41.1
N$53
  Top 0.254: 22.86,40.69 24,40.69 D83.C | 22.86,40.69 21.72,40.69 D84.A | KEY42.1 22.86,40.69
N$55
  Top 0.254: 33.15,40.69 34.29,40.69 D85.C | 33.15,40.69 31.77,40.69 D86.A | 33.15,40.69 33.15,37.03 KEY43.1
N$56
  Top 0.254: 43.2,40.69 44.35,40.69 D87.C | 43.2,40.69 42.06,40.69 D88.A | 43.2,40.69 43.2,37.03 KEY44.1
N$57
  Top 0.254: 53.26,40.69 54.41,40.69 D89.C | 53.26,40.69 52.12,40.69 D90.A | 53.26,40.69 53.26,37.03 KEY45.1
N$58
  Top 0.254: 63.55,40.69 64.69,40.69 D91.C | 63.55,40.69 62.41,40.69 D92.A | 63.55,40.69 63.55,37.03 KEY46.1
N$59
  Top 0.254: 73.61,40.69 74.75,40.69 D93.C | 73.61,40.69 72.47,40.69 D94.A | 73.61,40.69 73.61,37.03 KEY47.1
N$60
  Top 0.254: 83.9,40.69 85.04,40.69 D95.C | 83.9,40.69 82.75,40.69 D96.A | 83.9,40.69 83.9,37.03 KEY48.1
N$61
  Top 0.254: 12.8,33.15 13.95,33.15 D97.C | 12.8,33.15 11.43,33.15 D98.A | 12.8,33.15 12.8,29.26 KEY49.1
N$62
  Top 0.254: 22.86,33.15 24,33.15 D99.C | 22.86,33.15 21.72,33.15 D100.A | KEY50.1 22.86,33.15
N$64
  Top 0.254: 33.15,33.15 34.29,33.15 D101.C | 33.15,33.15 31.77,33.15 D102.A | 33.15,33.15 33.15,29.26 KEY51.1
N$65
  Top 0.254: 43.2,33.15 44.35,33.15 D103.C | 43.2,33.15 42.06,33.15 D104.A | 43.2,33.15 43.2,29.26 KEY52.1
N$66
  Top 0.254: 53.26,33.15 54.41,33.15 D105.C | 53.26,33.15 52.12,33.15 D106.A | 53.26,33.15 53.26,29.26 KEY53.1
N$67
  Top 0.254: 63.55,33.15 64.69,33.15 D107.C | 63.55,33.15 62.41,33.15 D108.A | 63.55,33.15 63.55,29.26 KEY54.1
N$68
  Top 0.254: 73.61,33.15 74.75,33.15 D109.C | 73.61,33.15 72.47,33.15 D110.A | 73.61,33.15 73.61,29.26 KEY55.1
N$69
  Top 0.254: 83.9,33.15 85.04,33.15 D111.C | 83.9,33.15 82.75,33.15 D112.A | 83.9,33.15 83.9,29.26 KEY56.1
N$70
  Top 0.254: 12.8,25.6 13.95,25.6 D113.C | 12.8,25.6 11.43,25.6 D114.A | 12.8,25.6 12.8,21.72 KEY57.1
N$71
  Top 0.254: 22.86,25.6 24,25.6 D115.C | 22.86,25.6 21.72,25.6 D116.A | KEY58.1 22.86,25.6
N$73
  Top 0.254: 33.15,25.6 34.29,25.6 D117.C | 33.15,25.6 31.77,25.6 D118.A | 33.15,25.6 33.15,21.72 KEY59.1
N$74
  Top 0.254: 43.2,25.6 44.35,25.6 D119.C | 43.2,25.6 42.06,25.6 D120.A | 43.2,25.6 43.2,21.72 KEY60.1
N$75
  Top 0.254: 53.26,25.6 54.41,25.6 D121.C | 53.26,25.6 52.12,25.6 D122.A | 53.26,25.6 53.26,21.72 KEY61.1
N$76
  Top 0.254: 63.55,25.6 64.69,25.6 D123.C | 63.55,25.6 62.41,25.6 D124.A | 63.55,25.6 63.55,21.72 KEY62.1
N$77
  Top 0.254: 73.61,25.6 74.75,25.6 D125.C | 73.61,25.6 72.47,25.6 D126.A | 73.61,25.6 73.61,21.72 KEY63.1
N$78
  Top 0.254: 83.9,25.6 85.04,25.6 D127.C | 83.9,25.6 82.75,25.6 D128.A | 83.9,25.6 83.9,21.72 KEY64.1
X0  (via drill 0.61)
  Top 0.254: D15.A 87.55,78.87 86.41,78.87 85.5,79.78 78.41,79.78 77.5,78.87 D13.A 77.27,78.87 76.35,79.78 69.27,79.78 68.35,78.87 67.44,78.87 D11.A 67.21,78.87 66.06,78.87 65.15,79.78 58.06,79.78 57.15,78.87 | D1.A 16.69,78.87 17.6,78.87 18.52,79.78 25.6,79.78 26.52,78.87 D3.A 26.75,78.87 27.89,78.87 28.8,79.78 35.89,79.78 36.8,78.87 D5.A 37.03,78.87 37.95,78.87 38.86,79.78 45.95,79.78 D7.A 47.55,78.18 | v50.06,17.83 50.06,15.77 IC2.13 | v50.52,38.18 48.46,40.23 48.46,77.27 47.55,78.18 | 57.15,78.87 56.01,78.87 55.09,79.78 49.15,79.78 47.55,78.18 | 57.15,78.87 D9.A
  Bottom 0.254: v50.06,17.83 50.06,24.46 50.52,24.92 v50.52,38.18
X1  (via drill 0.61)
  Top 0.254: v48.92,13.95 48.92,15.77 IC2.14
  Bottom 0.254: D17.A 16.69,71.32 17.83,71.32 18.75,72.24 25.6,72.24 26.52,71.32 D19.A 26.75,71.32 27.89,71.32 28.8,72.24 35.89,72.24 36.8,71.32 D21.A 37.03,71.32 37.95,71.32 38.86,72.24 45.95,72.24 46.86,71.32 D23.A 47.09,71.32 48.01,72.24 55.09,72.24 56.01,71.32 57.15,71.32 | 57.15,71.32 58.06,72.24 65.15,72.24 66.06,71.32 67.21,71.32 D27.A 67.44,71.32 68.58,71.32 69.49,72.24 76.35,72.24 D29.A 77.5,71.32 78.64,71.32 79.55,72.24 86.64,72.24 87.55,71.32 D31.A 87.78,71.09 88.7,70.18 88.7,32.46 88.24,32 84.58,32 80.24,27.66 70.64,27.66 68.81,25.83 68.81,24 57.84,13.03 49.84,13.03 v48.92,13.95 | 57.15,71.32 D25.A
X2  (via drill 0.61)
  Top 0.254: v47.78,17.83 47.78,15.77 IC2.15 | v48.01,34.75 48.01,62.41 47.09,63.32 D39.A
  Bottom 0.254: D47.A 87.55,63.32 86.41,63.32 85.5,62.41 78.41,62.41 77.5,63.32 D45.A 77.27,63.32 76.35,62.41 69.49,62.41 68.58,63.32 67.44,63.32 D43.A 67.21,63.32 66.06,63.32 65.15,62.41 58.06,62.41 57.15,63.32 | D33.A 16.69,63.32 17.6,63.32 18.52,62.41 25.6,62.41 26.52,63.32 D35.A 26.75,63.32 27.89,63.32 28.8,62.41 35.89,62.41 36.8,63.32 D37.A 37.03,63.32 37.95,63.32 38.86,62.41 45.95,62.41 46.86,63.32 D39.A 47.09,63.32 48.01,62.41 55.09,62.41 56.01,63.32 57.15,63.32 | v47.78,17.83 47.78,24.69 48.01,24.92 v48.01,34.75 | 57.15,63.32 D41.A
X3  (via drill 0.61)
  Top 0.254: IC2.12 51.44,15.09 v50.29,13.95
  Bottom 0.254: 57.15,56.01 56.01,56.01 55.09,56.92 48.01,56.92 47.09,56.01 D55.A 45.95,56.92 38.86,56.92 37.95,56.01 37.03,56.01 D53.A 36.8,56.01 35.66,56.01 34.75,56.92 27.66,56.92 26.75,56.01 D51.A 26.52,56.01 25.6,56.01 24.69,56.92 17.6,56.92 16.69,56.01 D49.A 16.46,55.78 15.32,54.63 15.32,40.23 20.34,35.2 23.55,35.2 25.15,33.6 25.15,32.92 30.4,27.66 33.6,27.66 35.43,25.83 35.43,25.38 44.81,16 48.23,16 v50.29,13.95 | D63.A 87.55,56.01 86.41,56.01 85.5,56.92 78.41,56.92 77.5,56.01 D61.A 77.27,56.01 76.35,56.92 69.27,56.92 68.35,56.01 67.44,56.01 D59.A 67.21,56.01 66.29,56.92 59.21,56.92 58.29,56.01 57.15,56.01 | 57.15,56.01 D57.A
X4  (via drill 0.61)
  Top 0.254: v47.55,11.43 46.41,10.29 46.41,9.83 IC2.1 | v57.84,12.12 57.84,24.46 58.29,24.92 58.29,47.09 57.15,48.23 D73.A
  Bottom 0.254: D65.A 16.69,48.46 17.83,48.46 18.75,49.38 25.6,49.38 26.52,48.46 D67.A 26.75,48.46 27.89,48.46 28.8,49.38 35.89,49.38 36.8,48.46 D69.A 37.03,48.46 37.95,48.46 38.86,49.38 45.95,49.38 46.86,48.46 D71.A 47.09,48.46 48.23,48.46 49.15,49.38 56.24,49.38 57.15,48.46 | D79.A 87.55,48.46 86.41,48.46 85.5,49.38 78.41,49.38 77.5,48.46 D77.A 76.35,49.38 69.49,49.38 68.58,48.46 67.44,48.46 D75.A 67.21,48.46 66.06,48.46 65.15,49.38 58.06,49.38 57.15,48.46 | v47.55,11.43 57.15,11.43 v57.84,12.12 | 57.15,48.46 D73.A
X5  (via drill 0.61)
  Top 0.254: IC2.5 51.44,10.29 v55.09,13.95
  Bottom 0.254: D81.A 16.46,40.69 16.46,42.29 16.92,42.75 24.46,42.75 26.52,40.69 D83.A 26.75,40.46 27.66,39.55 34.75,39.55 35.66,40.46 36.8,40.46 D85.A 37.03,40.46 37.95,40.46 38.86,39.55 45.95,39.55 46.86,40.46 D87.A 47.09,40.69 48.69,42.29 55.55,42.29 57.15,40.69 D89.A 57.15,40.46 58.29,40.46 59.21,39.55 66.29,39.55 | v55.09,13.95 58.06,13.95 66.75,22.63 66.75,24.46 66.29,24.92 66.29,39.55 | 66.29,39.55 67.21,40.46 D91.A 67.44,40.46 68.35,39.55 75.44,39.55 76.35,40.46 77.27,40.46 D93.A 77.5,40.46 78.41,39.55 85.5,39.55 86.41,40.46 87.55,40.46 D95.A
X6  (via drill 0.61)
  Top 0.254: v23.09,34.06 25.6,34.06 26.52,33.15 D99.A | IC2.2 47.78,9.6 47.78,8.91 49.84,6.86 54.41,6.86 56.46,8.91 56.46,16.69 53.49,19.66 49.84,19.66 45.95,23.55 45.95,32 46.86,32.92 D103.A | v60.81,34.06 65.15,34.06 66.06,33.15 67.21,33.15 D107.A
  Bottom 0.254: D107.A 67.44,33.15 68.35,33.15 69.27,34.06 76.35,34.06 77.27,33.15 D109.A 77.5,33.15 78.41,34.06 85.5,34.06 86.41,33.15 87.55,33.15 D111.A | v23.09,34.06 18.52,34.06 17.6,33.15 16.69,33.15 D97.A | 45.95,34.06 38.86,34.06 37.95,33.15 37.03,33.15 D101.A 36.8,33.15 35.89,34.06 28.8,34.06 27.89,33.15 26.75,33.15 D99.A | D103.A 45.95,34.06 | 57.15,34.06 57.15,35.2 52.81,39.55 51.66,39.55 50.52,40.69 50.52,41.15 49.84,41.83 49.15,41.83 48.01,40.69 48.01,36.12 45.95,34.06 | 57.15,34.06 D105.A | 57.15,34.06 v60.81,34.06
X7  (via drill 0.61)
  Top 0.254: D117.A v34.75,23.32 | D125.A 76.35,26.52 72.01,26.52 71.32,25.83 71.32,25.38 70.18,24.23 69.49,24.23 68.35,25.38 67.44,25.38 D123.A 67.21,25.38 v65.84,24 | v51.66,13.95 50.29,12.57 50.29,9.83 IC2.4 | D119.A 46.86,25.38 46.86,24.69 46.63,24.46 46.63,23.55 47.09,23.09 48.01,23.09 48.46,23.55 48.46,25.83 49.15,26.52 56.24,26.52 57.15,25.6 D121.A
  Bottom 0.254: D113.A 16.69,25.6 17.83,25.6 18.75,26.52 25.6,26.52 26.52,25.6 D115.A 26.75,25.38 27.66,25.38 29.72,23.32 v34.75,23.32 | D117.A 37.03,25.6 37.95,25.6 38.86,26.52 45.95,26.52 46.86,25.6 D119.A | D127.A 87.55,25.6 86.41,25.6 85.5,26.52 78.41,26.52 77.5,25.6 D125.A | v51.66,13.95 51.66,16.46 57.15,21.95 57.15,24 | D121.A 57.15,24 | 57.15,24 v65.84,24
Y0
  Top 0.254: D2.C 8.91,78.64 8.91,71.32 D18.C 8.91,71.09 8.91,63.55 D34.C 8.91,63.32 8.91,56.01 D50.C 8.91,55.78 8.91,48.46 D66.C | D98.C 8.91,33.15 8.91,40.46 D82.C | IC3.13 33.6,15.77 33.6,15.09 32.46,13.95 26.52,13.95 20.34,20.12 12.12,20.12 8.91,23.32 8.91,25.38 D114.C
  Bottom 0.254: D98.C 8.91,32.92 8.91,25.6 D114.C | D66.C 8.91,48.23 8.91,40.69 D82.C
Y1
  Top 0.254: D4.C 19.2,78.64 19.2,71.32 D20.C 19.2,71.09 19.2,63.55 D36.C 19.2,63.32 19.2,56.01 D52.C 19.2,55.78 19.2,48.46 D68.C 19.2,48.23 19.2,40.69 D84.C 19.2,40.46 19.2,33.15 D100.C 19.2,32.92 19.2,25.6 D116.C 19.2,25.38 19.2,23.09 27.89,14.4 31.77,14.4 32.23,14.86 32.23,15.77 IC3.14
Y2
  Top 0.254: IC3.15 31.09,15.77 31.09,23.55 29.26,25.38 D118.C 29.26,25.6 29.26,32.92 D102.C 29.26,33.15 29.26,40.46 D86.C 29.26,40.69 29.26,48.23 D70.C 29.26,48.46 29.26,55.78 D54.C 29.26,56.01 29.26,63.32 D38.C 29.26,63.55 29.26,71.09 D22.C 29.26,71.32 29.26,78.64 D6.C
Y3
  Top 0.254: IC3.12 34.98,15.77 34.98,21.03 39.32,25.38 D120.C 39.55,25.6 39.55,32.92 D104.C 39.55,33.15 39.55,40.46 D88.C 39.55,40.69 39.55,48.23 D72.C 39.55,48.46 39.55,55.78 D56.C 39.55,56.01 39.55,63.32 D40.C 39.55,63.55 39.55,71.09 D24.C 39.55,71.32 39.55,78.64 D8.C
Y4
  Top 0.254: D10.C 49.61,78.64 49.61,71.32 D26.C 49.61,71.09 49.61,63.55 D42.C 49.61,63.32 49.61,56.01 D58.C 49.61,55.78 49.61,48.46 D74.C 49.61,48.23 49.61,40.69 D90.C | IC3.1 29.95,9.83 29.95,10.29 31.77,12.12 37.26,12.12 37.49,12.34 40.69,12.34 46.63,6.4 54.86,6.4 56.92,8.46 56.92,17.83 54.63,20.12 52.81,20.12 49.61,23.32 49.61,25.38 D122.C
  Bottom 0.254: D90.C 49.61,40.46 49.61,33.15 D106.C 49.61,32.92 49.61,25.6 D122.C
Y5
  Top 0.254: D12.C 59.66,78.64 59.66,71.32 D28.C 59.66,71.09 59.66,63.55 D44.C 59.66,63.32 59.66,56.01 D60.C 59.66,55.78 59.66,48.46 D76.C 59.66,48.23 59.66,40.69 D92.C 59.66,40.46 59.66,33.15 D108.C 59.66,32.92 59.66,25.6 D124.C 59.66,25.38 59.66,10.52 55.09,5.94 36.8,5.94 34.98,7.77 34.98,9.6 IC3.5
Y6  (via drill 0.61)
  Top 0.254: D14.C 69.95,78.64 69.95,71.32 D30.C 69.95,71.09 69.95,63.55 D46.C 69.95,63.32 69.95,56.01 D62.C 69.95,55.78 69.95,48.46 D78.C 69.95,48.23 69.95,40.69 D94.C 69.95,40.46 69.95,33.15 D110.C 69.95,32.92 69.95,25.6 D126.C | v31.32,5.26 31.32,9.6 IC3.2
  Bottom 0.254: v31.32,5.26 33.83,2.74 49.84,2.74 69.72,22.63 69.72,25.38 D126.C
Y7
  Top 0.254: D16.C D32.C D48.C D64.C D80.C D96.C D112.C D128.C 80.01,25.38 60.12,5.49 36.35,5.49 33.83,8 33.83,9.6 IC3.4